# Altium schematic sheet Sheet1.SchDoc
size A3; DocumentNumber: 1; SheetNumber: 1; SheetTotal: 6
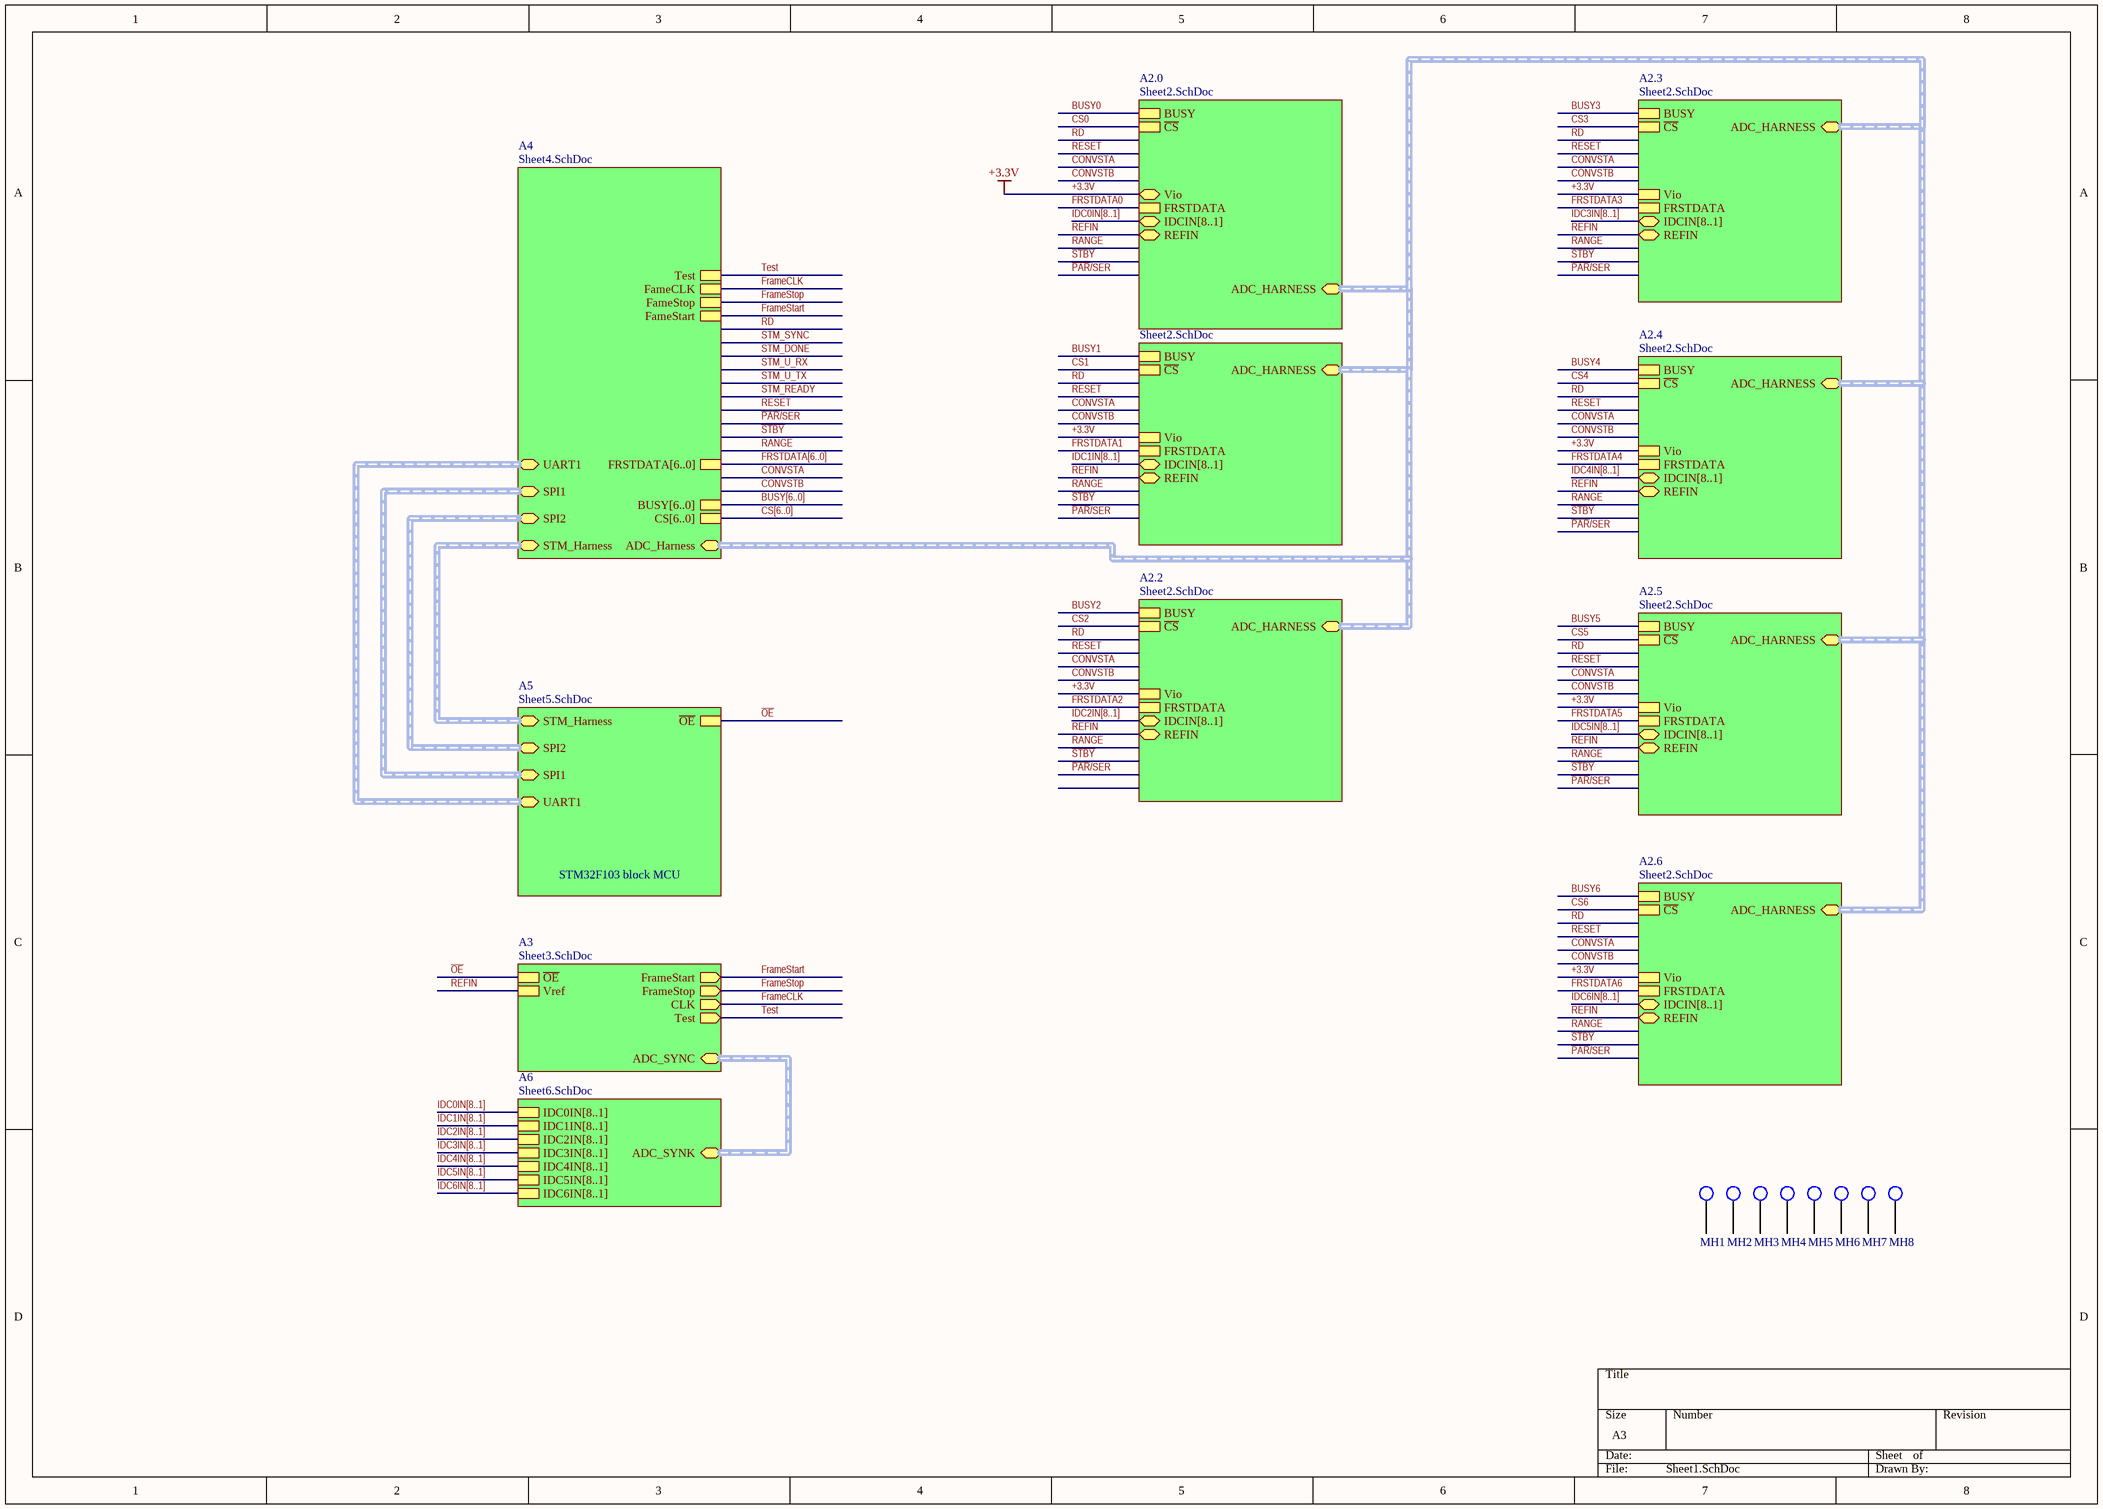
[diagram p0: Sheet1.SchDoc]

## Parts
MH1  HOLE  [MT]  (value not drawn)
MH2  HOLE  [MT]  (value not drawn)
MH3  HOLE  [MT]  (value not drawn)
MH4  HOLE  [MT]  (value not drawn)
MH5  HOLE  [MT]  (value not drawn)
MH6  HOLE  [MT]  (value not drawn)
MH7  HOLE  [MT]  (value not drawn)
MH8  HOLE  [MT]  (value not drawn)

## Sub-sheets
A2.0 = Sheet2.SchDoc: BUSY, ~{CS}, FRSTDATA, ADC_HARNESS (harness ADC_Harness), Vio, IDCIN[8..1], REFIN
A2.1 = Sheet2.SchDoc: BUSY, ~{CS}, Vio, FRSTDATA, ADC_HARNESS (harness ADC_Harness), IDCIN[8..1], REFIN
A2.2 = Sheet2.SchDoc: BUSY, ~{CS}, Vio, FRSTDATA, ADC_HARNESS (harness ADC_Harness), IDCIN[8..1], REFIN
A2.3 = Sheet2.SchDoc: BUSY, ~{CS}, Vio, FRSTDATA, ADC_HARNESS (harness ADC_Harness), IDCIN[8..1], REFIN
A2.4 = Sheet2.SchDoc: BUSY, ~{CS}, Vio, FRSTDATA, ADC_HARNESS (harness ADC_Harness), IDCIN[8..1], REFIN
A2.5 = Sheet2.SchDoc: BUSY, ~{CS}, Vio, FRSTDATA, ADC_HARNESS (harness ADC_Harness), IDCIN[8..1], REFIN
A2.6 = Sheet2.SchDoc: BUSY, ~{CS}, Vio, FRSTDATA, ADC_HARNESS (harness ADC_Harness), IDCIN[8..1], REFIN
A3 = Sheet3.SchDoc: FrameStart (out), FrameStop (out), CLK (out), ~{OE}, Test (out), Vref, ADC_SYNC (harness ADC_SYNC)
A4 = Sheet4.SchDoc: CS[6..0], BUSY[6..0], FRSTDATA[6..0], FameStart, FameStop, FameCLK, Test, ADC_Harness (harness ADC_Harness), STM_Harness (harness STM_Harness), SPI1 (harness SPI), SPI2 (harness SPI), UART1 (harness UART)
A5 = Sheet5.SchDoc: ~{OE}, STM_Harness (harness STM_Harness), SPI1 (harness SPI), SPI2 (harness SPI), UART1 (harness UART)  | BlockTitle: STM32F103 block MCU
A6 = Sheet6.SchDoc: IDC0IN[8..1], IDC1IN[8..1], IDC2IN[8..1], IDC3IN[8..1], IDC4IN[8..1], IDC5IN[8..1], IDC6IN[8..1], ADC_SYNK (harness ADC_SYNC)

## Nets
+3.3V: sheet A2.3/Vio, sheet A2.4/Vio, sheet A2.5/Vio, sheet A2.6/Vio, sheet A2.1/Vio, sheet A2.2/Vio, sheet A2.0/Vio
BUSY0: sheet A2.0/BUSY
BUSY1: sheet A2.1/BUSY
BUSY2: sheet A2.2/BUSY
BUSY3: sheet A2.3/BUSY
BUSY4: sheet A2.4/BUSY
BUSY5: sheet A2.5/BUSY
BUSY6: sheet A2.6/BUSY
CS0: sheet A2.0/~{CS}
CS1: sheet A2.1/~{CS}
CS2: sheet A2.2/~{CS}
CS3: sheet A2.3/~{CS}
CS4: sheet A2.4/~{CS}
CS5: sheet A2.5/~{CS}
CS6: sheet A2.6/~{CS}
FrameCLK: sheet A4/FameCLK, sheet A3/CLK
FrameStart: sheet A4/FameStart, sheet A3/FrameStart
FrameStop: sheet A4/FameStop, sheet A3/FrameStop
FRSTDATA0: sheet A2.0/FRSTDATA
FRSTDATA1: sheet A2.1/FRSTDATA
FRSTDATA2: sheet A2.2/FRSTDATA
FRSTDATA3: sheet A2.3/FRSTDATA
FRSTDATA4: sheet A2.4/FRSTDATA
FRSTDATA5: sheet A2.5/FRSTDATA
FRSTDATA6: sheet A2.6/FRSTDATA
~{OE}: sheet A3/~{OE}, sheet A5/~{OE}
REFIN: sheet A2.3/REFIN, sheet A2.4/REFIN, sheet A2.5/REFIN, sheet A2.6/REFIN, sheet A2.1/REFIN, sheet A2.2/REFIN, sheet A3/Vref, sheet A2.0/REFIN
Test: sheet A4/Test, sheet A3/Test

Not connected (* = marked no-connect by the designer): MH1 1; MH2 1; MH3 1; MH4 1; MH5 1; MH6 1; MH7 1; MH8 1

## Buses and harness runs
bus BUSY[6..0] = sheet A4/BUSY[6..0]
bus CS[6..0] = sheet A4/CS[6..0]
bus FRSTDATA[6..0] = sheet A4/FRSTDATA[6..0]
bus IDC0IN[8..1] = sheet A2.0/IDCIN[8..1]
bus IDC0IN[8..1] = sheet A6/IDC0IN[8..1]
bus IDC1IN[8..1] = sheet A2.1/IDCIN[8..1]
bus IDC1IN[8..1] = sheet A6/IDC1IN[8..1]
bus IDC2IN[8..1] = sheet A2.2/IDCIN[8..1]
bus IDC2IN[8..1] = sheet A6/IDC2IN[8..1]
bus IDC3IN[8..1] = sheet A2.3/IDCIN[8..1]
bus IDC3IN[8..1] = sheet A6/IDC3IN[8..1]
bus IDC4IN[8..1] = sheet A2.4/IDCIN[8..1]
bus IDC4IN[8..1] = sheet A6/IDC4IN[8..1]
bus IDC5IN[8..1] = sheet A2.5/IDCIN[8..1]
bus IDC5IN[8..1] = sheet A6/IDC5IN[8..1]
bus IDC6IN[8..1] = sheet A2.6/IDCIN[8..1]
bus IDC6IN[8..1] = sheet A6/IDC6IN[8..1]
harness sheet A2.0/ADC_HARNESS = sheet A2.1/ADC_HARNESS = sheet A2.2/ADC_HARNESS = sheet A2.3/ADC_HARNESS = sheet A2.4/ADC_HARNESS = sheet A2.5/ADC_HARNESS = sheet A2.6/ADC_HARNESS = sheet A4/ADC_Harness
harness sheet A3/ADC_SYNC = sheet A6/ADC_SYNK
harness sheet A4/SPI1 = sheet A5/SPI1
harness sheet A4/SPI2 = sheet A5/SPI2
harness sheet A4/STM_Harness = sheet A5/STM_Harness
harness sheet A4/UART1 = sheet A5/UART1

## Library data of the parts
MH1-MH8 = MT